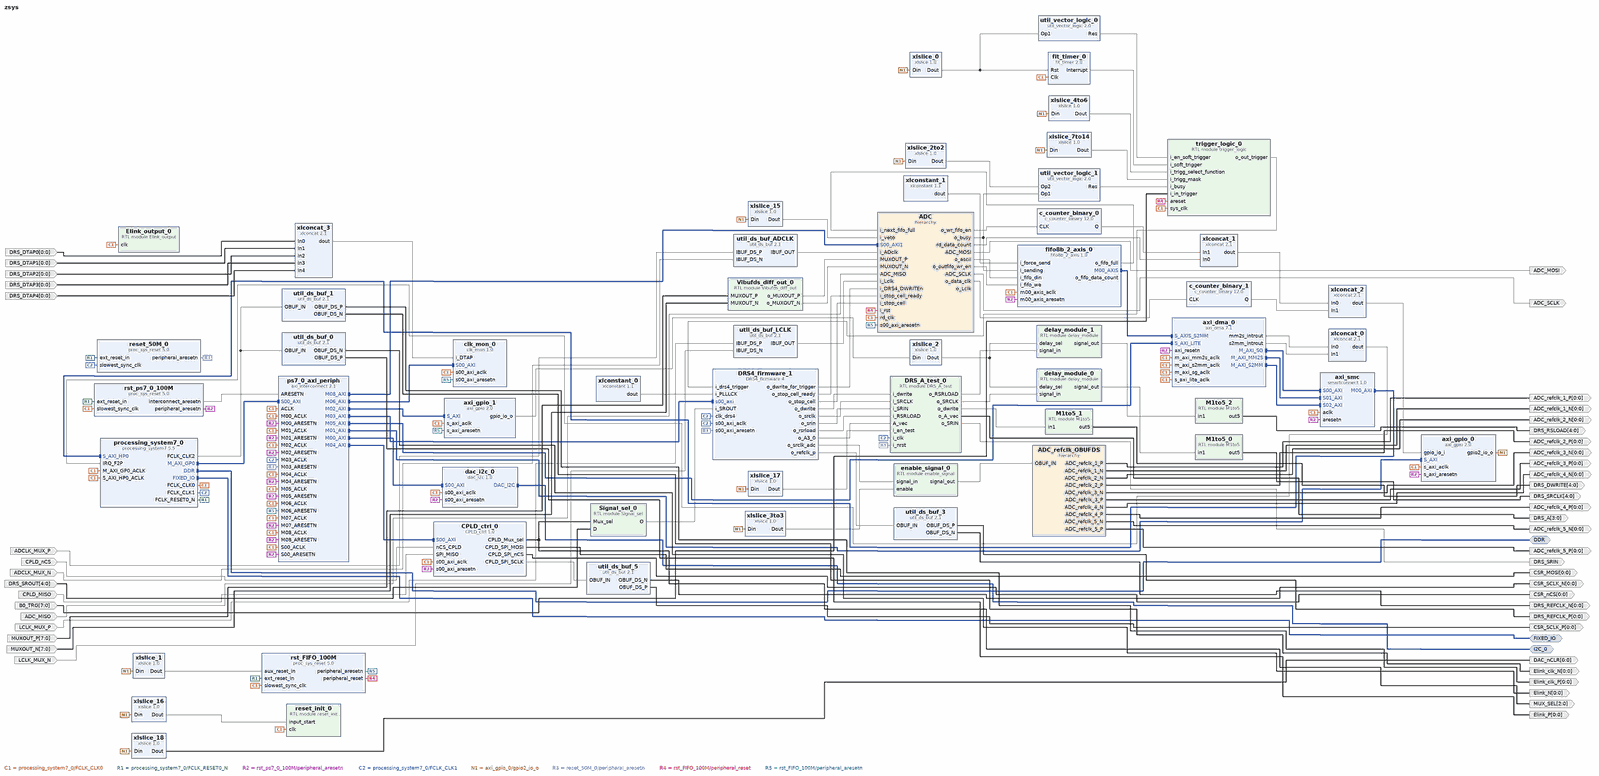
[diagram p0: block diagram of the top level, whole]
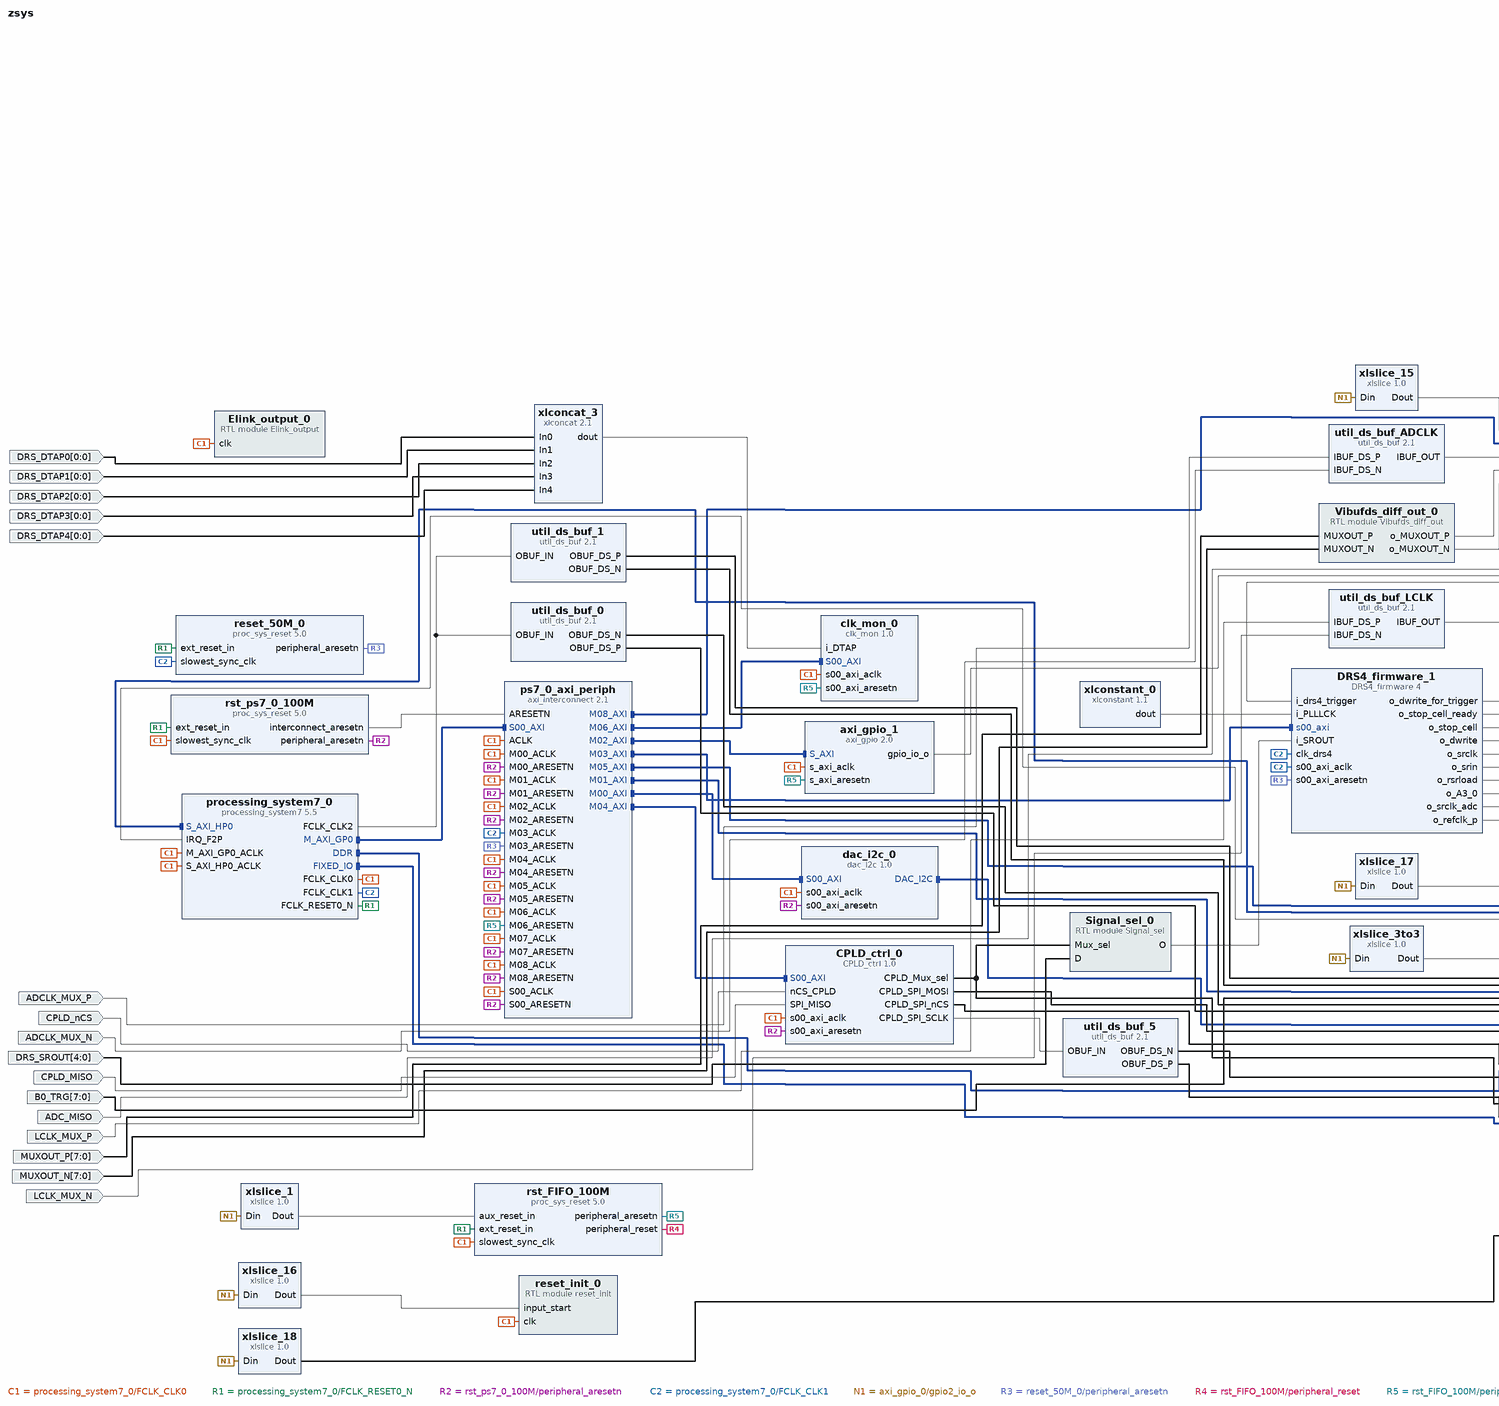
[diagram p1: block diagram of the top level, left part]
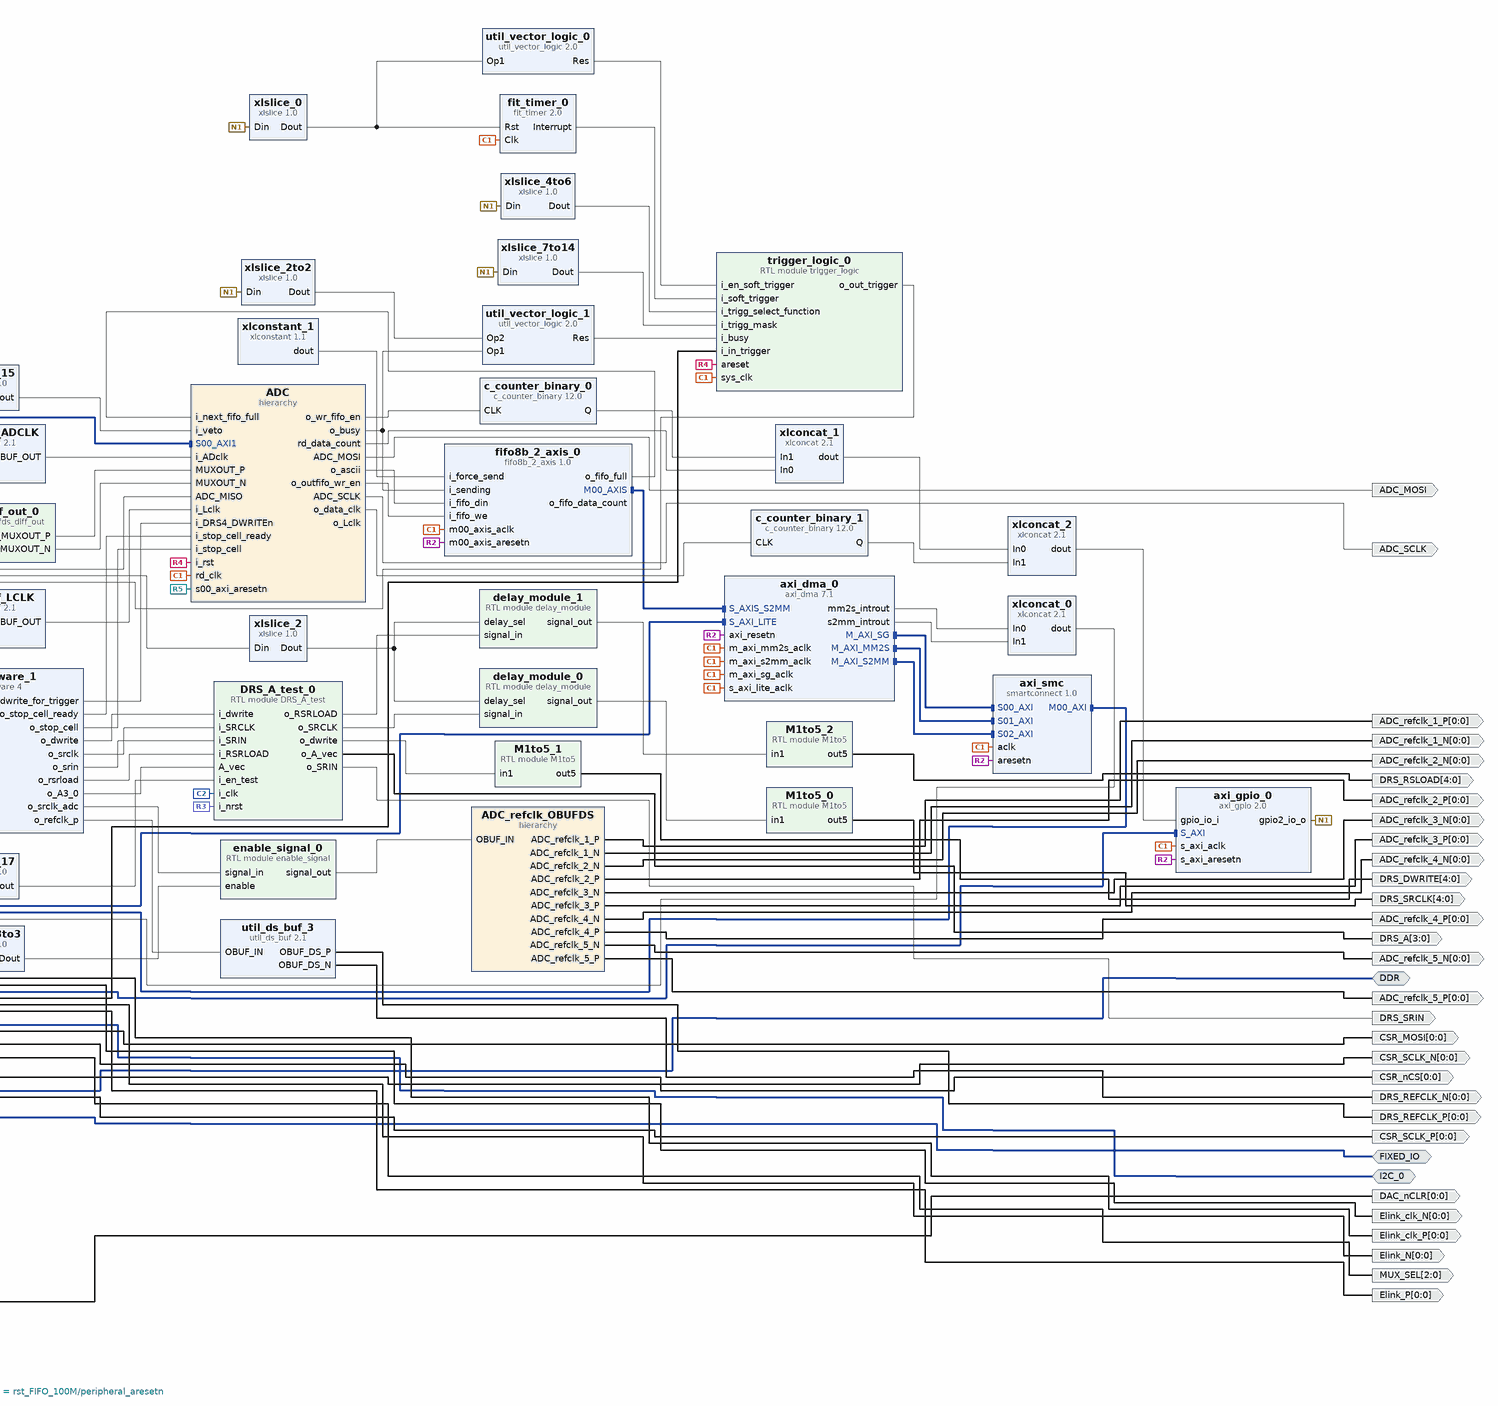
[diagram p2: block diagram of the top level, right part]
# Vivado block design zsys, xc7z015clg485-2, Vivado 2018.2
create_bd_design zsys

create_bd_intf_port -mode Master -vlnv xilinx.com:interface:ddrx_rtl:1.0 DDR
create_bd_intf_port -mode Master -vlnv xilinx.com:display_processing_system7:fixedio_rtl:1.0 FIXED_IO
create_bd_intf_port -mode Master -vlnv xilinx.com:interface:iic_rtl:1.0 I2C_0
create_bd_port -dir O -from 0 -to 0 -type clk DRS_REFCLK_P
create_bd_port -dir O -from 0 -to 0 -type clk DRS_REFCLK_N
create_bd_port -dir O -from 0 -to 0 -type clk ADC_refclk_1_P
create_bd_port -dir O -from 0 -to 0 -type clk ADC_refclk_1_N
create_bd_port -dir I -from 7 -to 0 B0_TRG
create_bd_port -dir O -from 4 -to 0 DRS_SRCLK
create_bd_port -dir O ADC_SCLK
create_bd_port -dir O ADC_MOSI
create_bd_port -dir O -from 4 -to 0 DRS_DWRITE
create_bd_port -dir O -from 4 -to 0 DRS_RSLOAD
create_bd_port -dir O -from 0 -to 0 -type clk ADC_refclk_2_N
create_bd_port -dir O -from 0 -to 0 -type clk ADC_refclk_2_P
create_bd_port -dir O -from 0 -to 0 -type clk ADC_refclk_3_N
create_bd_port -dir O -from 0 -to 0 -type clk ADC_refclk_3_P
create_bd_port -dir O -from 0 -to 0 -type clk ADC_refclk_4_N
create_bd_port -dir O -from 0 -to 0 -type clk ADC_refclk_4_P
create_bd_port -dir O -from 0 -to 0 -type clk ADC_refclk_5_N
create_bd_port -dir O -from 0 -to 0 -type clk ADC_refclk_5_P
create_bd_port -dir O -from 0 -to 0 -type clk CSR_SCLK_N
create_bd_port -dir O -from 0 -to 0 -type clk CSR_SCLK_P
create_bd_port -dir O -from 2 -to 0 MUX_SEL
create_bd_port -dir I -from 4 -to 0 DRS_SROUT
create_bd_port -dir I ADCLK_MUX_P
create_bd_port -dir I ADCLK_MUX_N
create_bd_port -dir O -from 0 -to 0 -type clk CSR_MOSI
create_bd_port -dir O -from 0 -to 0 -type clk CSR_nCS
create_bd_port -dir I CPLD_nCS
create_bd_port -dir I CPLD_MISO
create_bd_port -dir I ADC_MISO
create_bd_port -dir I LCLK_MUX_P
create_bd_port -dir I LCLK_MUX_N
create_bd_port -dir I -from 7 -to 0 -type data MUXOUT_P
create_bd_port -dir I -from 7 -to 0 -type data MUXOUT_N
create_bd_port -dir I -from 0 -to 0 DRS_DTAP0
create_bd_port -dir I -from 0 -to 0 DRS_DTAP1
create_bd_port -dir I -from 0 -to 0 DRS_DTAP2
create_bd_port -dir I -from 0 -to 0 DRS_DTAP3
create_bd_port -dir I -from 0 -to 0 DRS_DTAP4
create_bd_port -dir O -from 3 -to 0 DRS_A
create_bd_port -dir O DRS_SRIN
create_bd_port -dir O -from 0 -to 0 Elink_N
create_bd_port -dir O -from 0 -to 0 Elink_clk_P
create_bd_port -dir O -from 0 -to 0 Elink_clk_N
create_bd_port -dir O -from 0 -to 0 Elink_P
create_bd_port -dir O -from 0 -to 0 DAC_nCLR

create_bd_cell -type module -reference reset_init reset_init_0
create_bd_cell -type module -reference M1to5 M1to5_0
create_bd_cell -type hier ADC
create_bd_cell -type module -reference M1to5 M1to5_1
create_bd_cell -type module -reference M1to5 M1to5_2
create_bd_cell -type hier ADC_refclk_OBUFDS
create_bd_cell -type ip -vlnv xilinx.com:ip:axi_gpio:2.0 axi_gpio_0
set_property -dict [list \
  CONFIG.C_GPIO_WIDTH 32 \
  CONFIG.C_GPIO2_WIDTH 32 \
  CONFIG.C_IS_DUAL 1 \
  CONFIG.C_ALL_INPUTS 1 \
  CONFIG.C_ALL_OUTPUTS_2 1 \
] [get_bd_cells axi_gpio_0]
create_bd_cell -type ip -vlnv xilinx.com:ip:c_counter_binary:12.0 c_counter_binary_0
set_property -dict {CONFIG.Output_Width 12} [get_bd_cells c_counter_binary_0]
create_bd_cell -type ip -vlnv xilinx.com:ip:fit_timer:2.0 fit_timer_0
set_property -dict {CONFIG.C_NO_CLOCKS 700000000} [get_bd_cells fit_timer_0]
create_bd_cell -type ip -vlnv xilinx.com:ip:proc_sys_reset:5.0 reset_50M_0
create_bd_cell -type ip -vlnv xilinx.com:ip:processing_system7:5.5 processing_system7_0
set_property -dict [list \
  CONFIG.PCW_FCLK_CLK1_BUF TRUE \
  CONFIG.PCW_FCLK_CLK2_BUF TRUE \
  CONFIG.PCW_UIPARAM_DDR_FREQ_MHZ 533 \
  CONFIG.PCW_CPU_CPU_6X4X_MAX_RANGE 767 \
  CONFIG.PCW_APU_PERIPHERAL_FREQMHZ 666 \
  CONFIG.PCW_UART_PERIPHERAL_FREQMHZ 100 \
  CONFIG.PCW_FPGA0_PERIPHERAL_FREQMHZ 100 \
  CONFIG.PCW_FPGA1_PERIPHERAL_FREQMHZ 50 \
  CONFIG.PCW_FPGA2_PERIPHERAL_FREQMHZ 40 \
  CONFIG.PCW_USE_S_AXI_HP0 1 \
  CONFIG.PCW_USE_FABRIC_INTERRUPT 1 \
  CONFIG.PCW_EN_CLK1_PORT 1 \
  CONFIG.PCW_EN_CLK2_PORT 1 \
  CONFIG.PCW_IRQ_F2P_INTR 1 \
  CONFIG.PCW_PERIPHERAL_BOARD_PRESET part0 \
  CONFIG.PCW_PRESET_BANK0_VOLTAGE {LVCMOS 2.5V} \
  CONFIG.PCW_PRESET_BANK1_VOLTAGE {LVCMOS 1.8V} \
  CONFIG.PCW_UIPARAM_DDR_MEMORY_TYPE {DDR 3 (Low Voltage)} \
  CONFIG.PCW_UIPARAM_DDR_PARTNO {MT41J256M16 RE-125} \
  CONFIG.PCW_QSPI_PERIPHERAL_ENABLE 1 \
  CONFIG.PCW_QSPI_QSPI_IO {MIO 1 .. 6} \
  CONFIG.PCW_QSPI_GRP_SINGLE_SS_ENABLE 1 \
  CONFIG.PCW_QSPI_GRP_SINGLE_SS_IO {MIO 1 .. 6} \
  CONFIG.PCW_SINGLE_QSPI_DATA_MODE x4 \
  CONFIG.PCW_QSPI_GRP_FBCLK_ENABLE 1 \
  CONFIG.PCW_QSPI_GRP_FBCLK_IO {MIO 8} \
  CONFIG.PCW_ENET0_PERIPHERAL_ENABLE 1 \
  CONFIG.PCW_ENET0_ENET0_IO {MIO 16 .. 27} \
  CONFIG.PCW_ENET0_GRP_MDIO_ENABLE 1 \
  CONFIG.PCW_ENET0_GRP_MDIO_IO {MIO 52 .. 53} \
  CONFIG.PCW_ENET_RESET_ENABLE 1 \
  CONFIG.PCW_ENET_RESET_SELECT {Share reset pin} \
  CONFIG.PCW_ENET0_RESET_ENABLE 0 \
  CONFIG.PCW_SD0_PERIPHERAL_ENABLE 0 \
  CONFIG.PCW_UART0_PERIPHERAL_ENABLE 1 \
  CONFIG.PCW_UART0_UART0_IO {MIO 14 .. 15} \
  CONFIG.PCW_UART1_PERIPHERAL_ENABLE 0 \
  CONFIG.PCW_WDT_PERIPHERAL_ENABLE 1 \
  CONFIG.PCW_WDT_WDT_IO EMIO \
  CONFIG.PCW_USB0_PERIPHERAL_ENABLE 0 \
  CONFIG.PCW_USB_RESET_ENABLE 1 \
  CONFIG.PCW_I2C_RESET_ENABLE 0 \
  CONFIG.PCW_GPIO_MIO_GPIO_ENABLE 1 \
  CONFIG.PCW_GPIO_MIO_GPIO_IO MIO \
  CONFIG.PCW_FPGA_FCLK1_ENABLE 1 \
  CONFIG.PCW_FPGA_FCLK2_ENABLE 1 \
] [get_bd_cells processing_system7_0]
# 499 more settings of processing_system7_0 are not shown: defaults, MIO pin electricals, DDR timing, and values the tool derives
create_bd_cell -type ip -vlnv xilinx.com:ip:axi_interconnect:2.1 ps7_0_axi_periph
set_property -dict {CONFIG.NUM_MI 9} [get_bd_cells ps7_0_axi_periph]
create_bd_cell -type ip -vlnv xilinx.com:ip:proc_sys_reset:5.0 rst_ps7_0_100M
create_bd_cell -type ip -vlnv xilinx.com:ip:proc_sys_reset:5.0 rst_FIFO_100M
create_bd_cell -type ip -vlnv xilinx.com:ip:util_ds_buf:2.1 util_ds_buf_3
set_property -dict {CONFIG.C_BUF_TYPE OBUFDS} [get_bd_cells util_ds_buf_3]
create_bd_cell -type ip -vlnv xilinx.com:ip:util_vector_logic:2.0 util_vector_logic_0
set_property -dict {CONFIG.C_SIZE 1 CONFIG.C_OPERATION not} [get_bd_cells util_vector_logic_0]
create_bd_cell -type ip -vlnv xilinx.com:ip:util_vector_logic:2.0 util_vector_logic_1
set_property -dict {CONFIG.C_SIZE 1 CONFIG.C_OPERATION or} [get_bd_cells util_vector_logic_1]
create_bd_cell -type ip -vlnv xilinx.com:ip:xlconcat:2.1 xlconcat_0
create_bd_cell -type ip -vlnv xilinx.com:ip:xlconcat:2.1 xlconcat_1
set_property -dict {CONFIG.IN0_WIDTH 12 CONFIG.IN1_WIDTH 12 CONFIG.dout_width 24} [get_bd_cells xlconcat_1]
create_bd_cell -type ip -vlnv xilinx.com:ip:xlconstant:1.1 xlconstant_0
set_property -dict {CONFIG.CONST_VAL 0} [get_bd_cells xlconstant_0]
create_bd_cell -type ip -vlnv xilinx.com:ip:xlslice:1.0 xlslice_0
set_property -dict {CONFIG.DIN_TO 0 CONFIG.DIN_FROM 0 CONFIG.DIN_WIDTH 32} [get_bd_cells xlslice_0]
create_bd_cell -type ip -vlnv xilinx.com:ip:xlslice:1.0 xlslice_2to2
set_property -dict {CONFIG.DIN_TO 2 CONFIG.DIN_FROM 2 CONFIG.DIN_WIDTH 32 CONFIG.DOUT_WIDTH 1} [get_bd_cells xlslice_2to2]
create_bd_cell -type ip -vlnv xilinx.com:ip:xlslice:1.0 xlslice_16
set_property -dict {CONFIG.DIN_TO 16 CONFIG.DIN_FROM 16 CONFIG.DIN_WIDTH 32 CONFIG.DOUT_WIDTH 1} [get_bd_cells xlslice_16]
create_bd_cell -type ip -vlnv xilinx.com:ip:xlslice:1.0 xlslice_1
set_property -dict {CONFIG.DIN_TO 1 CONFIG.DIN_FROM 1 CONFIG.DIN_WIDTH 32 CONFIG.DOUT_WIDTH 1} [get_bd_cells xlslice_1]
create_bd_cell -type ip -vlnv xilinx.com:ip:xlslice:1.0 xlslice_4to6
set_property -dict {CONFIG.DIN_TO 4 CONFIG.DIN_FROM 6 CONFIG.DIN_WIDTH 32 CONFIG.DOUT_WIDTH 3} [get_bd_cells xlslice_4to6]
create_bd_cell -type ip -vlnv xilinx.com:ip:xlslice:1.0 xlslice_7to14
set_property -dict {CONFIG.DIN_TO 7 CONFIG.DIN_FROM 14 CONFIG.DIN_WIDTH 32 CONFIG.DOUT_WIDTH 8} [get_bd_cells xlslice_7to14]
create_bd_cell -type ip -vlnv xilinx.com:ip:util_ds_buf:2.1 util_ds_buf_5
set_property -dict {CONFIG.C_BUF_TYPE OBUFDS} [get_bd_cells util_ds_buf_5]
create_bd_cell -type module -reference Signal_sel Signal_sel_0
create_bd_cell -type ip -vlnv xilinx.com:ip:util_ds_buf:2.1 util_ds_buf_ADCLK
create_bd_cell -type module -reference enable_signal enable_signal_0
set_property -dict {CONFIG.signal_size 0} [get_bd_cells enable_signal_0]
create_bd_cell -type ip -vlnv xilinx.com:ip:xlslice:1.0 xlslice_3to3
set_property -dict {CONFIG.DIN_TO 3 CONFIG.DIN_FROM 3 CONFIG.DIN_WIDTH 32 CONFIG.DOUT_WIDTH 1} [get_bd_cells xlslice_3to3]
create_bd_cell -type ip -vlnv xilinx.com:ip:xlslice:1.0 xlslice_15
set_property -dict {CONFIG.DIN_TO 15 CONFIG.DIN_FROM 15 CONFIG.DIN_WIDTH 32 CONFIG.DOUT_WIDTH 1} [get_bd_cells xlslice_15]
create_bd_cell -type ip -vlnv xilinx.com:user:fifo8b_2_axis:1.0 fifo8b_2_axis_0
create_bd_cell -type ip -vlnv xilinx.com:ip:xlconcat:2.1 xlconcat_2
set_property -dict [list \
  CONFIG.NUM_PORTS 2 \
  CONFIG.IN0_WIDTH 24 \
  CONFIG.IN1_WIDTH 8 \
  CONFIG.IN2_WIDTH 1 \
  CONFIG.dout_width 32 \
] [get_bd_cells xlconcat_2]
create_bd_cell -type ip -vlnv xilinx.com:ip:util_ds_buf:2.1 util_ds_buf_LCLK
create_bd_cell -type ip -vlnv xilinx.com:ip:c_counter_binary:12.0 c_counter_binary_1
set_property -dict {CONFIG.Output_Width 8} [get_bd_cells c_counter_binary_1]
create_bd_cell -type ip -vlnv xilinx.com:ip:axi_gpio:2.0 axi_gpio_1
set_property -dict {CONFIG.C_ALL_OUTPUTS 1} [get_bd_cells axi_gpio_1]
create_bd_cell -type ip -vlnv xilinx.com:ip:xlslice:1.0 xlslice_2
set_property -dict {CONFIG.DIN_TO 0 CONFIG.DIN_FROM 9 CONFIG.DOUT_WIDTH 10} [get_bd_cells xlslice_2]
create_bd_cell -type module -reference delay_module delay_module_0
set_property -dict {CONFIG.Max_lut_number 31} [get_bd_cells delay_module_0]
create_bd_cell -type module -reference delay_module delay_module_1
set_property -dict {CONFIG.Max_lut_number 31} [get_bd_cells delay_module_1]
create_bd_cell -type module -reference Vibufds_diff_out Vibufds_diff_out_0
create_bd_cell -type ip -vlnv xilinx.com:ip:xlconstant:1.1 xlconstant_1
set_property -dict {CONFIG.CONST_VAL 0} [get_bd_cells xlconstant_1]
create_bd_cell -type ip -vlnv xilinx.com:ip:xlconcat:2.1 xlconcat_3
set_property -dict {CONFIG.NUM_PORTS 5} [get_bd_cells xlconcat_3]
create_bd_cell -type ip -vlnv xilinx.com:ip:xlslice:1.0 xlslice_17
set_property -dict {CONFIG.DIN_TO 17 CONFIG.DIN_FROM 17 CONFIG.DIN_WIDTH 32 CONFIG.DOUT_WIDTH 1} [get_bd_cells xlslice_17]
create_bd_cell -type module -reference DRS_A_test DRS_A_test_0
create_bd_cell -type ip -vlnv xilinx.com:user:DRS4_firmware:4 DRS4_firmware_1
create_bd_cell -type ip -vlnv xilinx.com:user:CPLD_ctrl:1.0 CPLD_ctrl_0
set_property -dict {CONFIG.SPI_word_lenght 14} [get_bd_cells CPLD_ctrl_0]
create_bd_cell -type ip -vlnv xilinx.com:user:clk_mon:1.0 clk_mon_0
create_bd_cell -type ip -vlnv xilinx.com:user:dac_i2c:1.0 dac_i2c_0
create_bd_cell -type module -reference Elink_output Elink_output_0
create_bd_cell -type ip -vlnv xilinx.com:ip:util_ds_buf:2.1 util_ds_buf_0
set_property -dict {CONFIG.C_BUF_TYPE OBUFDS} [get_bd_cells util_ds_buf_0]
create_bd_cell -type ip -vlnv xilinx.com:ip:util_ds_buf:2.1 util_ds_buf_1
set_property -dict {CONFIG.C_BUF_TYPE OBUFDS} [get_bd_cells util_ds_buf_1]
create_bd_cell -type ip -vlnv xilinx.com:ip:xlslice:1.0 xlslice_18
set_property -dict {CONFIG.DIN_TO 18 CONFIG.DIN_FROM 18 CONFIG.DIN_WIDTH 32 CONFIG.DOUT_WIDTH 1} [get_bd_cells xlslice_18]
create_bd_cell -type ip -vlnv xilinx.com:ip:axi_dma:7.1 axi_dma_0
set_property -dict {CONFIG.c_sg_length_width 16 CONFIG.c_sg_include_stscntrl_strm 0} [get_bd_cells axi_dma_0]
create_bd_cell -type ip -vlnv xilinx.com:ip:smartconnect:1.0 axi_smc
set_property -dict {CONFIG.NUM_SI 3} [get_bd_cells axi_smc]
create_bd_cell -type module -reference trigger_logic trigger_logic_0

# ---- hierarchy /ADC ----
current_bd_instance /ADC
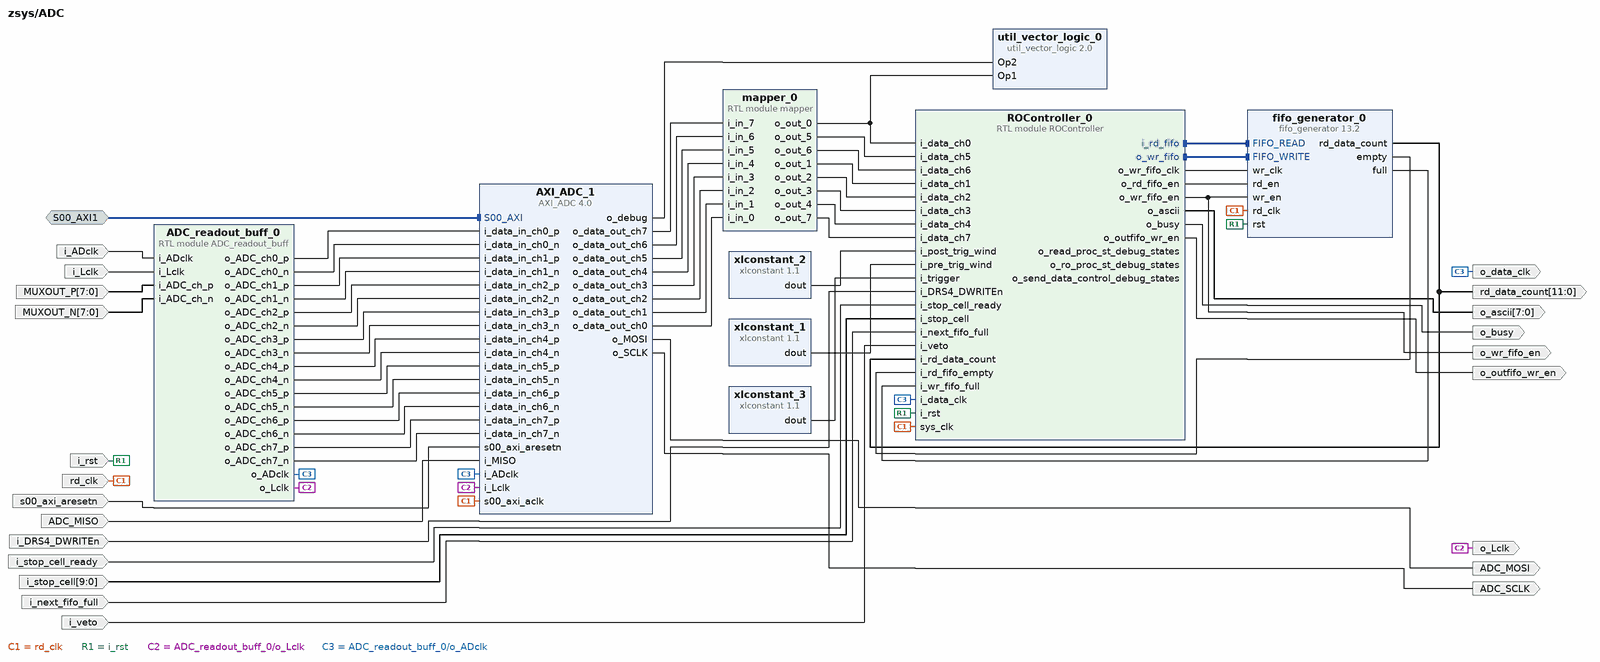
[diagram p3: block diagram inside /ADC]
create_bd_intf_pin -mode Slave -vlnv xilinx.com:interface:aximm_rtl:1.0 S00_AXI1
create_bd_pin -dir I ADC_MISO
create_bd_pin -dir O ADC_MOSI
create_bd_pin -dir O ADC_SCLK
create_bd_pin -dir I -type rst i_rst
create_bd_pin -dir I i_DRS4_DWRITEn
create_bd_pin -dir I i_stop_cell_ready
create_bd_pin -dir I -from 9 -to 0 i_stop_cell
create_bd_pin -dir O o_wr_fifo_en
create_bd_pin -dir I i_next_fifo_full
create_bd_pin -dir O o_busy
create_bd_pin -dir O -from 7 -to 0 o_ascii
create_bd_pin -dir O o_outfifo_wr_en
create_bd_pin -dir O -from 11 -to 0 rd_data_count
create_bd_pin -dir I i_Lclk
create_bd_pin -dir I i_ADclk
create_bd_pin -dir I i_veto
create_bd_pin -dir I -from 7 -to 0 MUXOUT_P
create_bd_pin -dir I -from 7 -to 0 MUXOUT_N
create_bd_pin -dir O -type clk o_data_clk
create_bd_pin -dir O o_Lclk
create_bd_pin -dir I -type clk rd_clk
create_bd_pin -dir I -type rst s00_axi_aresetn

create_bd_cell -type module -reference mapper mapper_0
create_bd_cell -type ip -vlnv xilinx.com:ip:fifo_generator:13.2 fifo_generator_0
set_property -dict [list \
  CONFIG.Fifo_Implementation Independent_Clocks_Block_RAM \
  CONFIG.Input_Data_Width 97 \
  CONFIG.Input_Depth 4096 \
  CONFIG.Output_Data_Width 97 \
  CONFIG.Full_Flags_Reset_Value 1 \
  CONFIG.Read_Data_Count true \
  CONFIG.Read_Data_Count_Width 12 \
  CONFIG.Enable_Safety_Circuit false \
] [get_bd_cells fifo_generator_0]
create_bd_cell -type ip -vlnv xilinx.com:ip:xlconstant:1.1 xlconstant_1
set_property -dict {CONFIG.CONST_WIDTH 12 CONFIG.CONST_VAL 100} [get_bd_cells xlconstant_1]
create_bd_cell -type ip -vlnv xilinx.com:ip:xlconstant:1.1 xlconstant_2
set_property -dict {CONFIG.CONST_WIDTH 12 CONFIG.CONST_VAL 1000} [get_bd_cells xlconstant_2]
create_bd_cell -type ip -vlnv xilinx.com:ip:xlconstant:1.1 xlconstant_3
set_property -dict {CONFIG.CONST_WIDTH 1 CONFIG.CONST_VAL 0} [get_bd_cells xlconstant_3]
create_bd_cell -type module -reference ADC_readout_buff ADC_readout_buff_0
create_bd_cell -type module -reference ROController ROController_0
create_bd_cell -type ip -vlnv xilinx.com:ip:util_vector_logic:2.0 util_vector_logic_0
set_property -dict {CONFIG.C_SIZE 12 CONFIG.C_OPERATION or} [get_bd_cells util_vector_logic_0]
create_bd_cell -type ip -vlnv xilinx.com:user:AXI_ADC:4.0 AXI_ADC_1

# ---- hierarchy /ADC_refclk_OBUFDS ----
current_bd_instance /ADC_refclk_OBUFDS
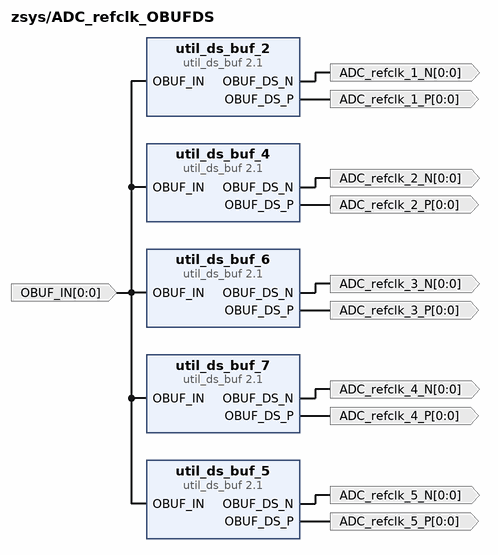
[diagram p4: block diagram inside /ADC_refclk_OBUFDS]
create_bd_pin -dir I -from 0 -to 0 -type clk OBUF_IN
create_bd_pin -dir O -from 0 -to 0 -type clk ADC_refclk_2_P
create_bd_pin -dir O -from 0 -to 0 -type clk ADC_refclk_2_N
create_bd_pin -dir O -from 0 -to 0 -type clk ADC_refclk_1_P
create_bd_pin -dir O -from 0 -to 0 -type clk ADC_refclk_1_N
create_bd_pin -dir O -from 0 -to 0 -type clk ADC_refclk_3_N
create_bd_pin -dir O -from 0 -to 0 -type clk ADC_refclk_3_P
create_bd_pin -dir O -from 0 -to 0 -type clk ADC_refclk_4_N
create_bd_pin -dir O -from 0 -to 0 -type clk ADC_refclk_4_P
create_bd_pin -dir O -from 0 -to 0 -type clk ADC_refclk_5_N
create_bd_pin -dir O -from 0 -to 0 -type clk ADC_refclk_5_P

create_bd_cell -type ip -vlnv xilinx.com:ip:util_ds_buf:2.1 util_ds_buf_2
set_property -dict {CONFIG.C_BUF_TYPE OBUFDS} [get_bd_cells util_ds_buf_2]
create_bd_cell -type ip -vlnv xilinx.com:ip:util_ds_buf:2.1 util_ds_buf_4
set_property -dict {CONFIG.C_BUF_TYPE OBUFDS} [get_bd_cells util_ds_buf_4]
create_bd_cell -type ip -vlnv xilinx.com:ip:util_ds_buf:2.1 util_ds_buf_5
set_property -dict {CONFIG.C_BUF_TYPE OBUFDS} [get_bd_cells util_ds_buf_5]
create_bd_cell -type ip -vlnv xilinx.com:ip:util_ds_buf:2.1 util_ds_buf_6
set_property -dict {CONFIG.C_BUF_TYPE OBUFDS} [get_bd_cells util_ds_buf_6]
create_bd_cell -type ip -vlnv xilinx.com:ip:util_ds_buf:2.1 util_ds_buf_7
set_property -dict {CONFIG.C_BUF_TYPE OBUFDS} [get_bd_cells util_ds_buf_7]

# ---- connections ----

current_bd_instance /ADC
connect_bd_intf_net [get_bd_intf_pins ROController_0/i_rd_fifo] [get_bd_intf_pins fifo_generator_0/FIFO_READ]
connect_bd_intf_net [get_bd_intf_pins ROController_0/o_wr_fifo] [get_bd_intf_pins fifo_generator_0/FIFO_WRITE]
connect_bd_intf_net -intf_net S00_AXI1_1 [get_bd_intf_pins S00_AXI1] [get_bd_intf_pins AXI_ADC_1/S00_AXI]
connect_bd_net -net s00_axi_ctrl_aclk_1 [get_bd_pins rd_clk] \
  [get_bd_pins fifo_generator_0/rd_clk] [get_bd_pins ROController_0/sys_clk] [get_bd_pins AXI_ADC_1/s00_axi_aclk]
connect_bd_net [get_bd_pins mapper_0/o_out_5] [get_bd_pins ROController_0/i_data_ch5]
connect_bd_net [get_bd_pins mapper_0/o_out_6] [get_bd_pins ROController_0/i_data_ch6]
connect_bd_net [get_bd_pins mapper_0/o_out_1] [get_bd_pins ROController_0/i_data_ch1]
connect_bd_net [get_bd_pins mapper_0/o_out_0] [get_bd_pins ROController_0/i_data_ch0] [get_bd_pins util_vector_logic_0/Op1]
connect_bd_net [get_bd_pins mapper_0/o_out_2] [get_bd_pins ROController_0/i_data_ch2]
connect_bd_net [get_bd_pins mapper_0/o_out_3] [get_bd_pins ROController_0/i_data_ch3]
connect_bd_net [get_bd_pins mapper_0/o_out_4] [get_bd_pins ROController_0/i_data_ch4]
connect_bd_net [get_bd_pins mapper_0/o_out_7] [get_bd_pins ROController_0/i_data_ch7]
connect_bd_net [get_bd_pins i_rst] [get_bd_pins fifo_generator_0/rst] [get_bd_pins ROController_0/i_rst]
connect_bd_net [get_bd_pins i_DRS4_DWRITEn] [get_bd_pins ROController_0/i_DRS4_DWRITEn]
connect_bd_net [get_bd_pins i_stop_cell_ready] [get_bd_pins ROController_0/i_stop_cell_ready]
connect_bd_net [get_bd_pins i_stop_cell] [get_bd_pins ROController_0/i_stop_cell]
connect_bd_net [get_bd_pins ROController_0/o_wr_fifo_en] [get_bd_pins o_wr_fifo_en] [get_bd_pins fifo_generator_0/wr_en]
connect_bd_net [get_bd_pins i_next_fifo_full] [get_bd_pins ROController_0/i_next_fifo_full]
connect_bd_net [get_bd_pins ROController_0/o_busy] [get_bd_pins o_busy]
connect_bd_net [get_bd_pins ROController_0/o_ascii] [get_bd_pins o_ascii]
connect_bd_net [get_bd_pins ROController_0/o_outfifo_wr_en] [get_bd_pins o_outfifo_wr_en]
connect_bd_net [get_bd_pins fifo_generator_0/rd_data_count] [get_bd_pins rd_data_count] [get_bd_pins ROController_0/i_rd_data_count]
connect_bd_net [get_bd_pins ROController_0/o_wr_fifo_clk] [get_bd_pins fifo_generator_0/wr_clk]
connect_bd_net [get_bd_pins ROController_0/o_rd_fifo_en] [get_bd_pins fifo_generator_0/rd_en]
connect_bd_net [get_bd_pins fifo_generator_0/empty] [get_bd_pins ROController_0/i_rd_fifo_empty]
connect_bd_net [get_bd_pins xlconstant_2/dout] [get_bd_pins ROController_0/i_post_trig_wind]
connect_bd_net [get_bd_pins xlconstant_1/dout] [get_bd_pins ROController_0/i_pre_trig_wind]
connect_bd_net [get_bd_pins ADC_readout_buff_0/o_Lclk] [get_bd_pins o_Lclk] [get_bd_pins AXI_ADC_1/i_Lclk]
connect_bd_net [get_bd_pins i_ADclk] [get_bd_pins ADC_readout_buff_0/i_ADclk]
connect_bd_net [get_bd_pins i_Lclk] [get_bd_pins ADC_readout_buff_0/i_Lclk]
connect_bd_net [get_bd_pins xlconstant_3/dout] [get_bd_pins ROController_0/i_trigger]
connect_bd_net -net AXI_ADC_0_o_data_clk [get_bd_pins ADC_readout_buff_0/o_ADclk] \
  [get_bd_pins o_data_clk] [get_bd_pins ROController_0/i_data_clk] [get_bd_pins AXI_ADC_1/i_ADclk]
connect_bd_net [get_bd_pins i_veto] [get_bd_pins ROController_0/i_veto]
connect_bd_net [get_bd_pins MUXOUT_P] [get_bd_pins ADC_readout_buff_0/i_ADC_ch_p]
connect_bd_net [get_bd_pins MUXOUT_N] [get_bd_pins ADC_readout_buff_0/i_ADC_ch_n]
# net o_ro_proc_st_debug_states has one end: ROController_0/o_ro_proc_st_debug_states
# net o_send_data_control_debug_states has one end: ROController_0/o_send_data_control_debug_states
# net o_read_proc_st_debug_states has one end: ROController_0/o_read_proc_st_debug_states
connect_bd_net [get_bd_pins fifo_generator_0/full] [get_bd_pins ROController_0/i_wr_fifo_full]
connect_bd_net [get_bd_pins s00_axi_aresetn] [get_bd_pins AXI_ADC_1/s00_axi_aresetn]
connect_bd_net [get_bd_pins ADC_readout_buff_0/o_ADC_ch0_p] [get_bd_pins AXI_ADC_1/i_data_in_ch0_p]
connect_bd_net [get_bd_pins ADC_readout_buff_0/o_ADC_ch0_n] [get_bd_pins AXI_ADC_1/i_data_in_ch0_n]
connect_bd_net [get_bd_pins ADC_readout_buff_0/o_ADC_ch1_p] [get_bd_pins AXI_ADC_1/i_data_in_ch1_p]
connect_bd_net [get_bd_pins ADC_readout_buff_0/o_ADC_ch1_n] [get_bd_pins AXI_ADC_1/i_data_in_ch1_n]
connect_bd_net [get_bd_pins ADC_readout_buff_0/o_ADC_ch2_p] [get_bd_pins AXI_ADC_1/i_data_in_ch2_p]
connect_bd_net [get_bd_pins ADC_readout_buff_0/o_ADC_ch2_n] [get_bd_pins AXI_ADC_1/i_data_in_ch2_n]
connect_bd_net [get_bd_pins ADC_readout_buff_0/o_ADC_ch3_p] [get_bd_pins AXI_ADC_1/i_data_in_ch3_p]
connect_bd_net [get_bd_pins ADC_readout_buff_0/o_ADC_ch3_n] [get_bd_pins AXI_ADC_1/i_data_in_ch3_n]
connect_bd_net [get_bd_pins ADC_readout_buff_0/o_ADC_ch4_p] [get_bd_pins AXI_ADC_1/i_data_in_ch4_p]
connect_bd_net [get_bd_pins ADC_readout_buff_0/o_ADC_ch4_n] [get_bd_pins AXI_ADC_1/i_data_in_ch4_n]
connect_bd_net [get_bd_pins ADC_readout_buff_0/o_ADC_ch5_p] [get_bd_pins AXI_ADC_1/i_data_in_ch5_p]
connect_bd_net [get_bd_pins ADC_readout_buff_0/o_ADC_ch5_n] [get_bd_pins AXI_ADC_1/i_data_in_ch5_n]
connect_bd_net [get_bd_pins ADC_readout_buff_0/o_ADC_ch6_p] [get_bd_pins AXI_ADC_1/i_data_in_ch6_p]
connect_bd_net [get_bd_pins ADC_readout_buff_0/o_ADC_ch6_n] [get_bd_pins AXI_ADC_1/i_data_in_ch6_n]
connect_bd_net [get_bd_pins ADC_readout_buff_0/o_ADC_ch7_p] [get_bd_pins AXI_ADC_1/i_data_in_ch7_p]
connect_bd_net [get_bd_pins ADC_readout_buff_0/o_ADC_ch7_n] [get_bd_pins AXI_ADC_1/i_data_in_ch7_n]
connect_bd_net [get_bd_pins ADC_MISO] [get_bd_pins AXI_ADC_1/i_MISO]
connect_bd_net [get_bd_pins AXI_ADC_1/o_data_out_ch7] [get_bd_pins mapper_0/i_in_7]
connect_bd_net [get_bd_pins AXI_ADC_1/o_data_out_ch6] [get_bd_pins mapper_0/i_in_6]
connect_bd_net [get_bd_pins AXI_ADC_1/o_data_out_ch5] [get_bd_pins mapper_0/i_in_5]
connect_bd_net [get_bd_pins AXI_ADC_1/o_data_out_ch4] [get_bd_pins mapper_0/i_in_4]
connect_bd_net [get_bd_pins AXI_ADC_1/o_data_out_ch3] [get_bd_pins mapper_0/i_in_3]
connect_bd_net [get_bd_pins AXI_ADC_1/o_data_out_ch2] [get_bd_pins mapper_0/i_in_2]
connect_bd_net [get_bd_pins AXI_ADC_1/o_data_out_ch1] [get_bd_pins mapper_0/i_in_1]
connect_bd_net [get_bd_pins AXI_ADC_1/o_data_out_ch0] [get_bd_pins mapper_0/i_in_0]
connect_bd_net [get_bd_pins AXI_ADC_1/o_MOSI] [get_bd_pins ADC_MOSI]
connect_bd_net [get_bd_pins AXI_ADC_1/o_SCLK] [get_bd_pins ADC_SCLK]
connect_bd_net [get_bd_pins AXI_ADC_1/o_debug] [get_bd_pins util_vector_logic_0/Op2]

current_bd_instance /ADC_refclk_OBUFDS
connect_bd_net -net DRS4_firmware_0_o_srclk_R2 [get_bd_pins OBUF_IN] \
  [get_bd_pins util_ds_buf_2/OBUF_IN] [get_bd_pins util_ds_buf_4/OBUF_IN] [get_bd_pins util_ds_buf_5/OBUF_IN] \
  [get_bd_pins util_ds_buf_6/OBUF_IN] [get_bd_pins util_ds_buf_7/OBUF_IN]
connect_bd_net [get_bd_pins util_ds_buf_4/OBUF_DS_P] [get_bd_pins ADC_refclk_2_P]
connect_bd_net [get_bd_pins util_ds_buf_4/OBUF_DS_N] [get_bd_pins ADC_refclk_2_N]
connect_bd_net [get_bd_pins util_ds_buf_2/OBUF_DS_P] [get_bd_pins ADC_refclk_1_P]
connect_bd_net [get_bd_pins util_ds_buf_2/OBUF_DS_N] [get_bd_pins ADC_refclk_1_N]
connect_bd_net [get_bd_pins util_ds_buf_6/OBUF_DS_N] [get_bd_pins ADC_refclk_3_N]
connect_bd_net [get_bd_pins util_ds_buf_6/OBUF_DS_P] [get_bd_pins ADC_refclk_3_P]
connect_bd_net [get_bd_pins util_ds_buf_7/OBUF_DS_N] [get_bd_pins ADC_refclk_4_N]
connect_bd_net [get_bd_pins util_ds_buf_7/OBUF_DS_P] [get_bd_pins ADC_refclk_4_P]
connect_bd_net [get_bd_pins util_ds_buf_5/OBUF_DS_N] [get_bd_pins ADC_refclk_5_N]
connect_bd_net [get_bd_pins util_ds_buf_5/OBUF_DS_P] [get_bd_pins ADC_refclk_5_P]

current_bd_instance /
connect_bd_intf_net [get_bd_intf_pins processing_system7_0/M_AXI_GP0] [get_bd_intf_pins ps7_0_axi_periph/S00_AXI]
connect_bd_intf_net [get_bd_intf_pins ps7_0_axi_periph/M00_AXI] [get_bd_intf_pins dac_i2c_0/S00_AXI]
connect_bd_intf_net [get_bd_intf_pins ps7_0_axi_periph/M01_AXI] [get_bd_intf_pins axi_gpio_0/S_AXI]
connect_bd_intf_net [get_bd_intf_pins ps7_0_axi_periph/M03_AXI] [get_bd_intf_pins DRS4_firmware_1/s00_axi]
connect_bd_intf_net [get_bd_intf_pins ps7_0_axi_periph/M04_AXI] [get_bd_intf_pins CPLD_ctrl_0/S00_AXI]
connect_bd_intf_net [get_bd_intf_pins axi_dma_0/M_AXI_SG] [get_bd_intf_pins axi_smc/S00_AXI]
connect_bd_intf_net [get_bd_intf_pins axi_smc/M00_AXI] [get_bd_intf_pins processing_system7_0/S_AXI_HP0]
connect_bd_intf_net [get_bd_intf_pins axi_dma_0/M_AXI_MM2S] [get_bd_intf_pins axi_smc/S01_AXI]
connect_bd_intf_net [get_bd_intf_pins axi_dma_0/M_AXI_S2MM] [get_bd_intf_pins axi_smc/S02_AXI]
connect_bd_intf_net [get_bd_intf_pins fifo8b_2_axis_0/M00_AXIS] [get_bd_intf_pins axi_dma_0/S_AXIS_S2MM]
connect_bd_intf_net [get_bd_intf_pins ps7_0_axi_periph/M05_AXI] [get_bd_intf_pins axi_dma_0/S_AXI_LITE]
connect_bd_intf_net [get_bd_intf_pins ps7_0_axi_periph/M02_AXI] [get_bd_intf_pins axi_gpio_1/S_AXI]
connect_bd_intf_net [get_bd_intf_pins ps7_0_axi_periph/M06_AXI] [get_bd_intf_pins clk_mon_0/S00_AXI]
connect_bd_intf_net [get_bd_intf_pins ps7_0_axi_periph/M08_AXI] [get_bd_intf_pins ADC/S00_AXI1]
connect_bd_intf_net [get_bd_intf_ports DDR] [get_bd_intf_pins processing_system7_0/DDR]
connect_bd_intf_net [get_bd_intf_ports FIXED_IO] [get_bd_intf_pins processing_system7_0/FIXED_IO]
connect_bd_intf_net [get_bd_intf_ports I2C_0] [get_bd_intf_pins dac_i2c_0/DAC_I2C]
connect_bd_net [get_bd_pins processing_system7_0/FCLK_CLK0] \
  [get_bd_pins reset_init_0/clk] [get_bd_pins axi_gpio_0/s_axi_aclk] [get_bd_pins fit_timer_0/Clk] \
  [get_bd_pins processing_system7_0/M_AXI_GP0_ACLK] [get_bd_pins processing_system7_0/S_AXI_HP0_ACLK] \
  [get_bd_pins rst_ps7_0_100M/slowest_sync_clk] [get_bd_pins rst_FIFO_100M/slowest_sync_clk] \
  [get_bd_pins fifo8b_2_axis_0/m00_axis_aclk] [get_bd_pins axi_gpio_1/s_axi_aclk] [get_bd_pins CPLD_ctrl_0/s00_axi_aclk] \
  [get_bd_pins clk_mon_0/s00_axi_aclk] [get_bd_pins dac_i2c_0/s00_axi_aclk] [get_bd_pins Elink_output_0/clk] \
  [get_bd_pins axi_dma_0/s_axi_lite_aclk] [get_bd_pins axi_dma_0/m_axi_sg_aclk] [get_bd_pins axi_dma_0/m_axi_mm2s_aclk] \
  [get_bd_pins axi_dma_0/m_axi_s2mm_aclk] [get_bd_pins axi_smc/aclk] [get_bd_pins trigger_logic_0/sys_clk] \
  [get_bd_pins ps7_0_axi_periph/ACLK] [get_bd_pins ps7_0_axi_periph/S00_ACLK] [get_bd_pins ps7_0_axi_periph/M00_ACLK] \
  [get_bd_pins ps7_0_axi_periph/M01_ACLK] [get_bd_pins ps7_0_axi_periph/M02_ACLK] [get_bd_pins ps7_0_axi_periph/M04_ACLK] \
  [get_bd_pins ps7_0_axi_periph/M05_ACLK] [get_bd_pins ADC/rd_clk] [get_bd_pins ps7_0_axi_periph/M06_ACLK] \
  [get_bd_pins ps7_0_axi_periph/M07_ACLK] [get_bd_pins ps7_0_axi_periph/M08_ACLK]
connect_bd_net [get_bd_pins processing_system7_0/FCLK_RESET0_N] \
  [get_bd_pins reset_50M_0/ext_reset_in] [get_bd_pins rst_ps7_0_100M/ext_reset_in] [get_bd_pins rst_FIFO_100M/ext_reset_in]
connect_bd_net [get_bd_pins rst_ps7_0_100M/peripheral_aresetn] \
  [get_bd_pins axi_gpio_0/s_axi_aresetn] [get_bd_pins fifo8b_2_axis_0/m00_axis_aresetn] \
  [get_bd_pins CPLD_ctrl_0/s00_axi_aresetn] [get_bd_pins dac_i2c_0/s00_axi_aresetn] [get_bd_pins axi_dma_0/axi_resetn] \
  [get_bd_pins axi_smc/aresetn] [get_bd_pins ps7_0_axi_periph/S00_ARESETN] [get_bd_pins ps7_0_axi_periph/M00_ARESETN] \
  [get_bd_pins ps7_0_axi_periph/M01_ARESETN] [get_bd_pins ps7_0_axi_periph/M02_ARESETN] \
  [get_bd_pins ps7_0_axi_periph/M04_ARESETN] [get_bd_pins ps7_0_axi_periph/M05_ARESETN] \
  [get_bd_pins ps7_0_axi_periph/M07_ARESETN] [get_bd_pins ps7_0_axi_periph/M08_ARESETN]
connect_bd_net [get_bd_pins rst_ps7_0_100M/interconnect_aresetn] [get_bd_pins ps7_0_axi_periph/ARESETN]
connect_bd_net [get_bd_pins processing_system7_0/FCLK_CLK1] \
  [get_bd_pins reset_50M_0/slowest_sync_clk] [get_bd_pins DRS_A_test_0/i_clk] [get_bd_pins DRS4_firmware_1/clk_drs4] \
  [get_bd_pins DRS4_firmware_1/s00_axi_aclk] [get_bd_pins ps7_0_axi_periph/M03_ACLK]
connect_bd_net [get_bd_pins xlconstant_0/dout] [get_bd_pins DRS4_firmware_1/i_PLLLCK]
connect_bd_net [get_bd_pins xlconcat_1/dout] [get_bd_pins xlconcat_2/In0]
connect_bd_net [get_bd_pins axi_gpio_0/gpio2_io_o] \
  [get_bd_pins xlslice_0/Din] [get_bd_pins xlslice_2to2/Din] [get_bd_pins xlslice_16/Din] [get_bd_pins xlslice_1/Din] \
  [get_bd_pins xlslice_4to6/Din] [get_bd_pins xlslice_7to14/Din] [get_bd_pins xlslice_3to3/Din] [get_bd_pins xlslice_15/Din] \
  [get_bd_pins xlslice_17/Din] [get_bd_pins xlslice_18/Din]
connect_bd_net [get_bd_pins util_ds_buf_3/OBUF_DS_P] [get_bd_ports DRS_REFCLK_P]
connect_bd_net [get_bd_pins util_ds_buf_3/OBUF_DS_N] [get_bd_ports DRS_REFCLK_N]
connect_bd_net -net util_ds_buf_2_OBUF_DS_P [get_bd_pins ADC_refclk_OBUFDS/ADC_refclk_1_P] [get_bd_ports ADC_refclk_1_P]
connect_bd_net -net util_ds_buf_2_OBUF_DS_N [get_bd_pins ADC_refclk_OBUFDS/ADC_refclk_1_N] [get_bd_ports ADC_refclk_1_N]
connect_bd_net -net DRS4_firmware_0_o_srclk_R2 [get_bd_pins DRS4_firmware_1/o_srclk_adc] [get_bd_pins enable_signal_0/signal_in]
connect_bd_net [get_bd_pins reset_50M_0/peripheral_aresetn] \
  [get_bd_pins DRS_A_test_0/i_nrst] [get_bd_pins DRS4_firmware_1/s00_axi_aresetn] [get_bd_pins ps7_0_axi_periph/M03_ARESETN]
connect_bd_net [get_bd_pins DRS4_firmware_1/o_dwrite] [get_bd_pins DRS_A_test_0/i_dwrite]
connect_bd_net [get_bd_pins DRS4_firmware_1/o_refclk_p] [get_bd_pins util_ds_buf_3/OBUF_IN]
connect_bd_net [get_bd_pins DRS4_firmware_1/o_srclk] [get_bd_pins DRS_A_test_0/i_SRCLK]
connect_bd_net [get_bd_pins DRS4_firmware_1/o_srin] [get_bd_pins DRS_A_test_0/i_SRIN]
connect_bd_net [get_bd_pins DRS4_firmware_1/o_rsrload] [get_bd_pins DRS_A_test_0/i_RSRLOAD]
connect_bd_net [get_bd_pins DRS4_firmware_1/o_A3_0] [get_bd_pins DRS_A_test_0/A_vec]
connect_bd_net [get_bd_pins rst_FIFO_100M/peripheral_reset] [get_bd_pins trigger_logic_0/areset] [get_bd_pins ADC/i_rst]
connect_bd_net [get_bd_pins c_counter_binary_0/Q] [get_bd_pins xlconcat_1/In1]
connect_bd_net -net i_in_trigger_1 [get_bd_ports B0_TRG] [get_bd_pins trigger_logic_0/i_in_trigger]
connect_bd_net -net xlslice_2_Dout2 [get_bd_pins xlslice_4to6/Dout] [get_bd_pins trigger_logic_0/i_trigg_select_function]
connect_bd_net -net xlslice_3_Dout1 [get_bd_pins xlslice_7to14/Dout] [get_bd_pins trigger_logic_0/i_trigg_mask]
connect_bd_net [get_bd_pins xlslice_0/Dout] [get_bd_pins fit_timer_0/Rst] [get_bd_pins util_vector_logic_0/Op1]
connect_bd_net [get_bd_pins trigger_logic_0/o_out_trigger] [get_bd_pins DRS4_firmware_1/i_drs4_trigger]
connect_bd_net [get_bd_pins fit_timer_0/Interrupt] [get_bd_pins trigger_logic_0/i_soft_trigger]
connect_bd_net [get_bd_pins util_vector_logic_0/Res] [get_bd_pins trigger_logic_0/i_en_soft_trigger]
connect_bd_net [get_bd_pins util_vector_logic_1/Res] [get_bd_pins trigger_logic_0/i_busy]
connect_bd_net -net xlslice_11_Dout [get_bd_pins xlslice_16/Dout] [get_bd_pins reset_init_0/input_start]
connect_bd_net [get_bd_pins xlslice_2to2/Dout] [get_bd_pins util_vector_logic_1/Op2]
connect_bd_net [get_bd_pins M1to5_0/out5] [get_bd_ports DRS_SRCLK]
connect_bd_net [get_bd_pins ADC/ADC_SCLK] [get_bd_ports ADC_SCLK]
connect_bd_net [get_bd_pins ADC/ADC_MOSI] [get_bd_ports ADC_MOSI]
connect_bd_net -net fifo_generator_0_rd_data_count [get_bd_pins ADC/rd_data_count] [get_bd_pins xlconcat_1/In0]
connect_bd_net -net ROController_0_o_wr_fifo_en [get_bd_pins ADC/o_wr_fifo_en] [get_bd_pins c_counter_binary_0/CLK]
connect_bd_net [get_bd_pins DRS4_firmware_1/o_dwrite_for_trigger] [get_bd_pins ADC/i_DRS4_DWRITEn]
connect_bd_net [get_bd_pins DRS4_firmware_1/o_stop_cell_ready] [get_bd_pins ADC/i_stop_cell_ready]
connect_bd_net [get_bd_pins DRS4_firmware_1/o_stop_cell] [get_bd_pins ADC/i_stop_cell]
connect_bd_net [get_bd_pins ADC/o_busy] [get_bd_pins util_vector_logic_1/Op1] [get_bd_pins fifo8b_2_axis_0/i_sending]
connect_bd_net [get_bd_pins ADC/o_ascii] [get_bd_pins fifo8b_2_axis_0/i_fifo_din]
connect_bd_net [get_bd_pins ADC/o_outfifo_wr_en] [get_bd_pins fifo8b_2_axis_0/i_fifo_we]
connect_bd_net [get_bd_pins xlconcat_0/dout] [get_bd_pins processing_system7_0/IRQ_F2P]
connect_bd_net [get_bd_pins axi_dma_0/mm2s_introut] [get_bd_pins xlconcat_0/In0]
connect_bd_net [get_bd_pins axi_dma_0/s2mm_introut] [get_bd_pins xlconcat_0/In1]
connect_bd_net -net i_next_fifo_full_1 [get_bd_pins fifo8b_2_axis_0/o_fifo_full] [get_bd_pins ADC/i_next_fifo_full]
connect_bd_net [get_bd_pins M1to5_1/out5] [get_bd_ports DRS_DWRITE]
connect_bd_net [get_bd_pins M1to5_2/out5] [get_bd_ports DRS_RSLOAD]
connect_bd_net -net util_ds_buf_4_OBUF_DS_N [get_bd_pins ADC_refclk_OBUFDS/ADC_refclk_2_N] [get_bd_ports ADC_refclk_2_N]
connect_bd_net -net util_ds_buf_4_OBUF_DS_P [get_bd_pins ADC_refclk_OBUFDS/ADC_refclk_2_P] [get_bd_ports ADC_refclk_2_P]
connect_bd_net -net ADC_refclk_OBUFDS_OBUF_DS_N_0 [get_bd_pins ADC_refclk_OBUFDS/ADC_refclk_3_N] [get_bd_ports ADC_refclk_3_N]
connect_bd_net -net ADC_refclk_OBUFDS_OBUF_DS_P_0 [get_bd_pins ADC_refclk_OBUFDS/ADC_refclk_3_P] [get_bd_ports ADC_refclk_3_P]
connect_bd_net -net ADC_refclk_OBUFDS_OBUF_DS_N_1 [get_bd_pins ADC_refclk_OBUFDS/ADC_refclk_4_N] [get_bd_ports ADC_refclk_4_N]
connect_bd_net -net ADC_refclk_OBUFDS_OBUF_DS_P_1 [get_bd_pins ADC_refclk_OBUFDS/ADC_refclk_4_P] [get_bd_ports ADC_refclk_4_P]
connect_bd_net -net ADC_refclk_OBUFDS_OBUF_DS_N_2 [get_bd_pins ADC_refclk_OBUFDS/ADC_refclk_5_N] [get_bd_ports ADC_refclk_5_N]
connect_bd_net -net ADC_refclk_OBUFDS_OBUF_DS_P_2 [get_bd_pins ADC_refclk_OBUFDS/ADC_refclk_5_P] [get_bd_ports ADC_refclk_5_P]
connect_bd_net [get_bd_pins CPLD_ctrl_0/CPLD_SPI_SCLK] [get_bd_pins util_ds_buf_5/OBUF_IN]
connect_bd_net [get_bd_pins util_ds_buf_5/OBUF_DS_N] [get_bd_ports CSR_SCLK_N]
connect_bd_net [get_bd_pins util_ds_buf_5/OBUF_DS_P] [get_bd_ports CSR_SCLK_P]
connect_bd_net [get_bd_pins CPLD_ctrl_0/CPLD_Mux_sel] [get_bd_ports MUX_SEL] [get_bd_pins Signal_sel_0/Mux_sel]
connect_bd_net [get_bd_ports DRS_SROUT] [get_bd_pins Signal_sel_0/D]
connect_bd_net [get_bd_pins Signal_sel_0/O] [get_bd_pins DRS4_firmware_1/i_SROUT]
connect_bd_net [get_bd_ports ADCLK_MUX_P] [get_bd_pins util_ds_buf_ADCLK/IBUF_DS_P]
connect_bd_net [get_bd_ports ADCLK_MUX_N] [get_bd_pins util_ds_buf_ADCLK/IBUF_DS_N]
connect_bd_net [get_bd_pins util_ds_buf_ADCLK/IBUF_OUT] [get_bd_pins ADC/i_ADclk]
connect_bd_net [get_bd_pins enable_signal_0/signal_out] [get_bd_pins ADC_refclk_OBUFDS/OBUF_IN]
connect_bd_net [get_bd_pins xlslice_3to3/Dout] [get_bd_pins enable_signal_0/enable]
connect_bd_net [get_bd_pins xlslice_15/Dout] [get_bd_pins ADC/i_veto]
connect_bd_net [get_bd_pins CPLD_ctrl_0/CPLD_SPI_MOSI] [get_bd_ports CSR_MOSI]
connect_bd_net [get_bd_pins CPLD_ctrl_0/CPLD_SPI_nCS] [get_bd_ports CSR_nCS]
connect_bd_net [get_bd_ports CPLD_nCS] [get_bd_pins CPLD_ctrl_0/nCS_CPLD]
connect_bd_net [get_bd_ports CPLD_MISO] [get_bd_pins CPLD_ctrl_0/SPI_MISO]
connect_bd_net [get_bd_ports ADC_MISO] [get_bd_pins ADC/ADC_MISO]
connect_bd_net [get_bd_pins ADC/o_data_clk] [get_bd_pins c_counter_binary_1/CLK]
connect_bd_net [get_bd_pins xlconcat_2/dout] [get_bd_pins axi_gpio_0/gpio_io_i]
connect_bd_net -net util_ds_buf_ADCLK1_IBUF_OUT [get_bd_pins util_ds_buf_LCLK/IBUF_OUT] [get_bd_pins ADC/i_Lclk]
connect_bd_net [get_bd_ports LCLK_MUX_P] [get_bd_pins util_ds_buf_LCLK/IBUF_DS_P]
connect_bd_net [get_bd_ports LCLK_MUX_N] [get_bd_pins util_ds_buf_LCLK/IBUF_DS_N]
connect_bd_net [get_bd_pins c_counter_binary_1/Q] [get_bd_pins xlconcat_2/In1]
# net Net has one end: ADC/o_Lclk
connect_bd_net [get_bd_pins xlslice_1/Dout] [get_bd_pins rst_FIFO_100M/aux_reset_in]
# net o_fifo_data_count has one end: fifo8b_2_axis_0/o_fifo_data_count
connect_bd_net [get_bd_pins delay_module_0/signal_out] [get_bd_pins M1to5_0/in1]
connect_bd_net [get_bd_pins axi_gpio_1/gpio_io_o] [get_bd_pins xlslice_2/Din]
connect_bd_net [get_bd_pins xlslice_2/Dout] [get_bd_pins delay_module_0/delay_sel] [get_bd_pins delay_module_1/delay_sel]
connect_bd_net [get_bd_pins rst_FIFO_100M/peripheral_aresetn] \
  [get_bd_pins axi_gpio_1/s_axi_aresetn] [get_bd_pins clk_mon_0/s00_axi_aresetn] [get_bd_pins ps7_0_axi_periph/M06_ARESETN] \
  [get_bd_pins ADC/s00_axi_aresetn]
connect_bd_net [get_bd_pins delay_module_1/signal_out] [get_bd_pins M1to5_2/in1]
connect_bd_net [get_bd_ports MUXOUT_P] [get_bd_pins Vibufds_diff_out_0/MUXOUT_P]
connect_bd_net [get_bd_ports MUXOUT_N] [get_bd_pins Vibufds_diff_out_0/MUXOUT_N]
connect_bd_net [get_bd_pins xlconstant_1/dout] [get_bd_pins fifo8b_2_axis_0/i_force_send]
connect_bd_net -net util_ds_buf_0_BUFH_O [get_bd_pins xlconcat_3/dout] [get_bd_pins clk_mon_0/i_DTAP]
connect_bd_net -net DRS_DTAP0_1 [get_bd_ports DRS_DTAP0] [get_bd_pins xlconcat_3/In0]
connect_bd_net -net DRS_DTAP1_1 [get_bd_ports DRS_DTAP1] [get_bd_pins xlconcat_3/In1]
connect_bd_net -net DRS_DTAP2_1 [get_bd_ports DRS_DTAP2] [get_bd_pins xlconcat_3/In2]
connect_bd_net -net DRS_DTAP3_1 [get_bd_ports DRS_DTAP3] [get_bd_pins xlconcat_3/In3]
connect_bd_net -net DRS_DTAP4_1 [get_bd_ports DRS_DTAP4] [get_bd_pins xlconcat_3/In4]
connect_bd_net [get_bd_pins DRS_A_test_0/o_A_vec] [get_bd_ports DRS_A]
connect_bd_net -net xlslice_3to4_Dout [get_bd_pins xlslice_17/Dout] [get_bd_pins DRS_A_test_0/i_en_test]
connect_bd_net [get_bd_pins DRS_A_test_0/o_RSRLOAD] [get_bd_pins delay_module_1/signal_in]
connect_bd_net [get_bd_pins DRS_A_test_0/o_SRCLK] [get_bd_pins delay_module_0/signal_in]
connect_bd_net [get_bd_pins DRS_A_test_0/o_SRIN] [get_bd_ports DRS_SRIN]
connect_bd_net [get_bd_pins DRS_A_test_0/o_dwrite] [get_bd_pins M1to5_1/in1]
connect_bd_net [get_bd_pins util_ds_buf_0/OBUF_DS_N] [get_bd_ports Elink_N]
connect_bd_net [get_bd_pins util_ds_buf_1/OBUF_DS_P] [get_bd_ports Elink_clk_P]
connect_bd_net [get_bd_pins util_ds_buf_1/OBUF_DS_N] [get_bd_ports Elink_clk_N]
connect_bd_net [get_bd_pins processing_system7_0/FCLK_CLK2] [get_bd_pins util_ds_buf_1/OBUF_IN] [get_bd_pins util_ds_buf_0/OBUF_IN]
connect_bd_net [get_bd_pins util_ds_buf_0/OBUF_DS_P] [get_bd_ports Elink_P]
connect_bd_net -net xlslice_5_Dout [get_bd_pins xlslice_18/Dout] [get_bd_ports DAC_nCLR]
connect_bd_net [get_bd_pins Vibufds_diff_out_0/o_MUXOUT_P] [get_bd_pins ADC/MUXOUT_P]
connect_bd_net [get_bd_pins Vibufds_diff_out_0/o_MUXOUT_N] [get_bd_pins ADC/MUXOUT_N]

# ---- address map ----
assign_bd_address -offset 0x00000000 -range 1G -target_address_space [get_bd_addr_spaces axi_dma_0/Data_MM2S] [get_bd_addr_segs processing_system7_0/S_AXI_HP0/HP0_DDR_LOWOCM]
assign_bd_address -offset 0x00000000 -range 1G -target_address_space [get_bd_addr_spaces axi_dma_0/Data_S2MM] [get_bd_addr_segs processing_system7_0/S_AXI_HP0/HP0_DDR_LOWOCM]
assign_bd_address -offset 0x00000000 -range 1G -target_address_space [get_bd_addr_spaces axi_dma_0/Data_SG] [get_bd_addr_segs processing_system7_0/S_AXI_HP0/HP0_DDR_LOWOCM]
assign_bd_address -offset 0x40400000 -range 64K -target_address_space [get_bd_addr_spaces processing_system7_0/Data] [get_bd_addr_segs axi_dma_0/S_AXI_LITE/Reg]
assign_bd_address -offset 0x41200000 -range 64K -target_address_space [get_bd_addr_spaces processing_system7_0/Data] [get_bd_addr_segs axi_gpio_0/S_AXI/Reg]
assign_bd_address -offset 0x41210000 -range 64K -target_address_space [get_bd_addr_spaces processing_system7_0/Data] [get_bd_addr_segs axi_gpio_1/S_AXI/Reg]
assign_bd_address -offset 0x43C00000 -range 64K -target_address_space [get_bd_addr_spaces processing_system7_0/Data] [get_bd_addr_segs dac_i2c_0/S00_AXI/S00_AXI_reg]
assign_bd_address -offset 0x43C10000 -range 64K -target_address_space [get_bd_addr_spaces processing_system7_0/Data] [get_bd_addr_segs ADC/AXI_ADC_1/S00_AXI/S00_AXI_reg]
assign_bd_address -offset 0x43C20000 -range 64K -target_address_space [get_bd_addr_spaces processing_system7_0/Data] [get_bd_addr_segs DRS4_firmware_1/s00_axi/reg0]
assign_bd_address -offset 0x43C30000 -range 64K -target_address_space [get_bd_addr_spaces processing_system7_0/Data] [get_bd_addr_segs CPLD_ctrl_0/S00_AXI/S00_AXI_reg]
assign_bd_address -offset 0x43C40000 -range 64K -target_address_space [get_bd_addr_spaces processing_system7_0/Data] [get_bd_addr_segs clk_mon_0/S00_AXI/S00_AXI_reg]

validate_bd_design
save_bd_design
